# EAGLE schematic Initial (EAGLE 6.5.0)
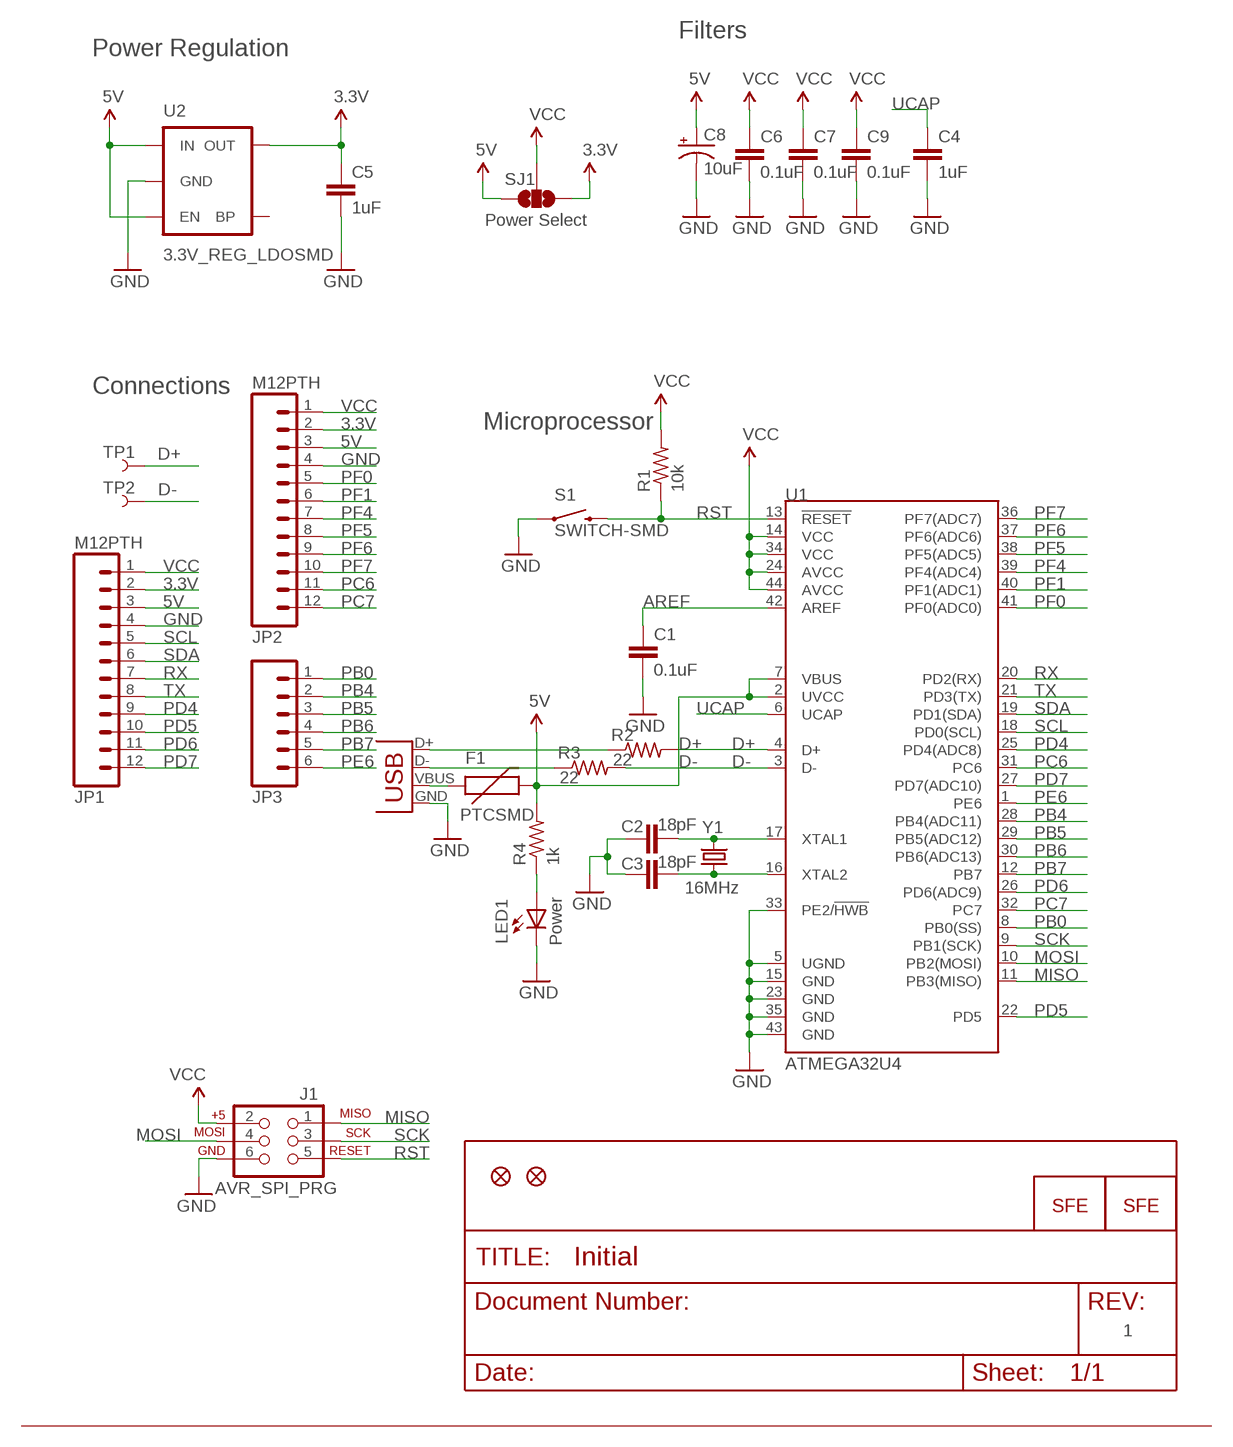
[diagram p0: schematic, sheet 1]

## Parts
C1  0.1uF  CAP0805  [0805]
C2  18pF  CAP0805  [0805]
C3  18pF  CAP0805  [0805]
C4  1uF  CAP0402-CAP  [0402-CAP]
C5  1uF  CAP0402-CAP  [0402-CAP]
C6  0.1uF  CAP0402-CAP  [0402-CAP]
C7  0.1uF  CAP0402-CAP  [0402-CAP]
C8  10uF  CAP_POL1206  [EIA3216]
C9  0.1uF  CAP0402-CAP  [0402-CAP]
F1  PTCSMD  [PTC-1206]
J1  AVR_SPI_PRG  AVR_SPI_PRG_6PTH  [2X3]
JP1  M12PTH  [1X12]
JP2  M12PTH  [1X12]
JP3  M06SIP  [1X06]
JP4  LOGO-SFENEW  [SFE-NEW-WEBLOGO]
JP5  LOGO-SFESK  [SFE-LOGO-FLAME]
JP6  FIDUCIALUFIDUCIAL  [MICRO-FIDUCIAL]
JP7  FIDUCIALUFIDUCIAL  [MICRO-FIDUCIAL]
LED1  Power  LED0603  [LED-0603]
R1  10k  R-US_M0805  [M0805]
R2  22  R-US_M0805  [M0805]
R3  22  R-US_M0805  [M0805]
R4  1k  R-US_M0805  [M0805]
S1  SWITCH-SMD  SWITCH-MOMENTARY-2SMD  [TACTILE_SWITCH_SMD]
SJ1  Power Select  SOLDERJUMPER_2WAYPASTE2&3  [SJ_3_PASTE2&3]
TP1  TEST-POINT3  [PAD.03X.03]
TP2  TEST-POINT3  [PAD.03X.03]
U1  ATMEGA32U4  ATMEGA32U4QFN2  [QFN-44-NOPAD]
U2  3.3V_REG_LDOSMD  V_REG_LDOSMD  [SOT23-5]
X1  USBSMD  [USB-MINIB]
Y1  16MHz  CRYSTAL5X3  [CRYSTAL-SMD-5X3]

## Nets
3.3V: C5.1 JP1.2 JP2.2 SJ1.1 U2.5(OUT)
5V: C8.A(+) JP1.3 JP2.3 SJ1.3 U2.1(IN) U2.3(EN)
AREF: C1.1 U1.42(AREF)
D+: R2.1 R2.2 TP1.P$1 U1.4(D+) X1.D+
D-: R3.1 R3.2 TP2.P$1 U1.3(D-) X1.D-
GND: C1.2 C2.1 C3.1 C4.2 C5.2 C6.2 C7.2 C8.C(-) C9.2 J1.6 JP1.4 JP2.4 LED1.C S1.1 U1.5(UGND) U1.15(GND) U1.23(GND) U1.33(PE2/!HWB) U1.35(GND) U1.43(GND) U2.2(GND) X1.GND
MISO: J1.1 U1.11(PB3(MISO))
MOSI: J1.4 U1.10(PB2(MOSI))
N$2: C2.2 U1.17(XTAL1) Y1.3
N$3: C3.2 U1.16(XTAL2) Y1.1
N$4: F1.1 X1.VBUS
N$9: LED1.A R4.1
PB0: JP3.1 U1.8(PB0(SS))
PB4: JP3.2 U1.28(PB4(ADC11))
PB5: JP3.3 U1.29(PB5(ADC12))
PB6: JP3.4 U1.30(PB6(ADC13))
PB7: JP3.5 U1.12(PB7)
PC6: JP2.11 U1.31(PC6)
PC7: JP2.12 U1.32(PC7)
PD4: JP1.9 U1.25(PD4(ADC8))
PD5: JP1.10 U1.22(PD5)
PD6: JP1.11 U1.26(PD6(ADC9))
PD7: JP1.12 U1.27(PD7(ADC10))
PE6: JP3.6 U1.1(PE6)
PF0: JP2.5 U1.41(PF0(ADC0))
PF1: JP2.6 U1.40(PF1(ADC1))
PF4: JP2.7 U1.39(PF4(ADC4))
PF5: JP2.8 U1.38(PF5(ADC5))
PF6: JP2.9 U1.37(PF6(ADC6))
PF7: JP2.10 U1.36(PF7(ADC7))
RST: J1.5 R1.1 S1.3 U1.13(!RESET)
RX: JP1.7 U1.20(PD2(RX))
SCK: J1.3 U1.9(PB1(SCK))
SCL: JP1.5 U1.18(PD0(SCL))
SDA: JP1.6 U1.19(PD1(SDA))
TX: JP1.8 U1.21(PD3(TX))
UCAP: C4.1 U1.6(UCAP)
VBUS: F1.2 R4.2 U1.2(UVCC) U1.7(VBUS) ; supply symbol labelled 5V
VCC: C6.1 C7.1 C9.1 J1.2 JP1.1 JP2.1 R1.2 SJ1.2 U1.14(VCC) U1.24(AVCC) U1.34(VCC) U1.44(AVCC)
Unconnected: U2.4(BP)

## Notes on the sheet
- Filters
- Power Regulation
- Connections
- Microprocessor
- 1

## Library data of the parts
C1-C7 C9 = SparkFun:CAP: Capacitor Standard 0603 ceramic capacitor, and 0.1" leaded capacitor.
C8 = SparkFun:CAP_POL: Capacitor Polarized These are standard SMD and PTH capacitors. Normally 10uF, 47uF, and 100uF in electrolytic and tantalum varieties. Always verify the external diameter of the through hole cap, it varies with capacity, voltage, and manufacturer. The EIA devices should be standard.
F1 = SparkFun:PTC: Resettable Fuse PTC Resettable Fuse. Spark Fun Electronics SKU : COM-08357
J1 = SparkFun:AVR_SPI_PRG_6: AVR ISP 6 Pin This is the reduced ISP connector for AVR programming. Common on Arduino. This footprint will take up less PCB space and can be used with a 10-pin to 6-pin adapter such as SKU: BOB-08508
JP1 JP2 = SparkFun:M12: Header 12 Standard 12-pin 0.1" header. Use with straight break away headers (SKU : PRT-00116), right angle break away headers (PRT-00553), swiss pins (PRT-00743), machine pins (PRT-00117), and female headers (PRT-00115).
JP3 = SparkFun:M06: Header 6 Standard 6-pin 0.1" header. Use with straight break away headers (SKU : PRT-00116), right angle break away headers (PRT-00553), swiss pins (PRT-00743), machine pins (PRT-00117), and female headers (PRT-00115). Molex polarized connector foot print use with SKU : PRT-08094 with associated crimp pins and housings. NOTES ON THE VARIANTS LOCK and LOCK_LONGPADS... This footprint was designed to help hold the alignment of a through-hole component (i.e. 6-pin header) while soldering it into place. You may notice that each hole has been shifted either up or down by 0.005 of an inch from it's more standard position (which is a perfectly straight line). This slight alteration caused the pins (the squares in the middle) to touch the edges of the holes. Because they are alternating, it causes a "brace" to hold the component in place. 0.005 has proven to be the perfect amount of "off-center" position when using our standard breakaway headers. Although looks a little odd when you look at the bare footprint, once you have a header in there, the alteration is very hard to notice. Also, if you push a header all the way into place, it is covered up entirely on the bottom side. This idea of altering the position of holes to aid alignment will be further integrated into the Sparkfun Library for other footprints. It can help hold any component with 3 or more connection pins.
JP4 JP5 = SparkFun:LOGO-SFE: Spark Fun Electronics PCB Logo This is the standard Spark Fun Electronics PCB logo.
JP6 JP7 = SparkFun:FIDUCIAL: Fiducial Alignment Points Various fiducial points for machine vision alignment.
LED1 = SparkFun:LED: LEDs Standard schematic elements and footprints for 5mm, 3mm, 1206, and 0603 sized LEDs. 5mm - Spark Fun Electronics SKU : COM-00529 (and others)
R1-R4 = resistor:R-US_: RESISTOR, American symbol
S1 = SparkFun:SWITCH-MOMENTARY-2
SJ1 = SparkFun:SOLDERJUMPER_2WAY: Solder Jumper 2 way solder jumper
TP1 TP2 = SparkFun:TEST-POINT
U1 = SparkFun:ATMEGA32U4
U2 = SparkFun:V_REG_LDO: Voltage Regulator LDO Standard 150mA LDO voltage regulator in SOT-23 layout. Micrel part MIC5205. BP (by-pass) pin is used to lower output noise with 470pF cap.
X1 = SparkFun:USB: USB Connectors USB-B-PTH is fully proven SKU : PRT-00139 USB-miniB is fully proven SKU : PRT-00587 USB-A-PCB is untested. USB-A-H is throughly reviewed, but untested. Spark Fun Electronics SKU : PRT-00437 USB-B-SMT is throughly reviewed, but untested. Needs silkscreen touching up. USB-A-S has not been used/tested USB-MB-H has not been used/tested
Y1 = SparkFun:CRYSTAL: Crystals Various standard crystals. Proven footprints. Spark Fun Electronics SKU : COM-00534